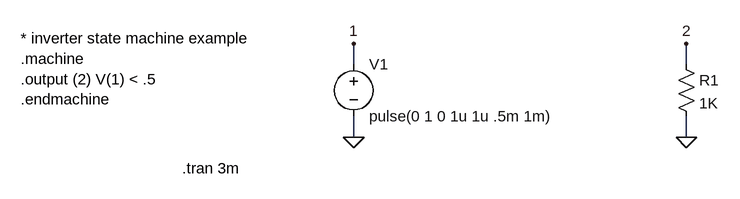
[diagram p0: schematic builtin_04_inverter.asc]
builtin_04_inverter.asc, the LTspice schematic file:
Version 4
SHEET 1 880 680
WIRE 224 416 224 384
WIRE 736 416 736 384
WIRE 224 528 224 496
WIRE 736 528 736 496
FLAG 224 528 0
FLAG 736 528 0
FLAG 224 384 1
FLAG 736 384 2
SYMBOL voltage 224 400 R0
SYMATTR InstName V1
SYMATTR Value pulse(0 1 0 1u 1u .5m 1m)
SYMBOL res 720 400 R0
SYMATTR InstName R1
SYMATTR Value 1K
TEXT -288 376 Left 2 !* inverter state machine example\n.machine\n.output (2) V(1) < .5\n.endmachine
TEXT -40 576 Left 2 !.tran 3m

The netlist it stands for:
* builtin_04_inverter.asc
V1 1 0 pulse(0 1 0 1u 1u .5m 1m)
R1 2 0 1K
* inverter state machine example
.machine
.output (2) V(1) < .5
.endmachine
.tran 3m
.backanno
.end